# EAGLE schematic RX-Super-Regenerative-1Transistor-ElektorSeptember2007 (EAGLE 7.2.0)
Elektor FM Broadcast Super-Regenerative Receiver Burkhard Kainka's super-regenerative FM receiver from Elektor September 2007. http://www.vk2zay.net/article/195 http://siva666siva.webs.com/FM.PDF
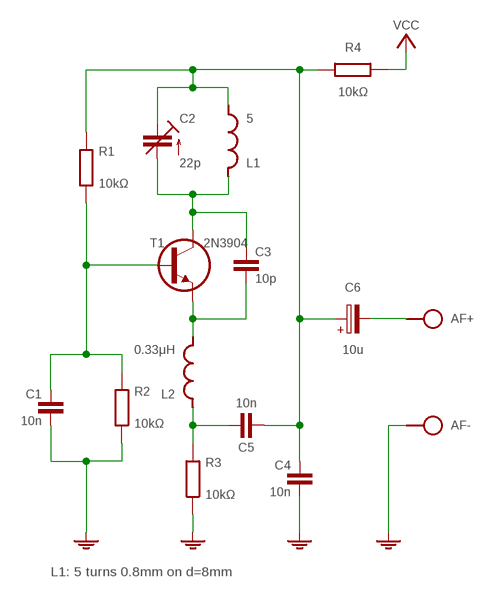
[diagram p0: schematic, sheet 1]

## Parts
AF+  SPAD  [SPAD]
AF-  SPAD  [SPAD]
C1  10n  C050-020X036/V  [C050-020X036/V]
C2  22p  C-TR-PH20127  [TRIM-2222-808]
C3  10p  C050-020X036/V  [C050-020X036/V]
C4  10n  C025-024X044  [C025-024X044]
C5  10n  C-H050-020X036  [C050-020X036]
C6  10u  CPOLE2,5-3  [E2,5-3]
L1  5  L-SHORTL-04-5/5V-X  [L-04-5/5V-X]
L2  0.33μH  L-SHORT02/7V  [L-02/7V]
R1  10kΩ  R0204/10  [0204/10]
R2  10kΩ  R0204/10  [0204/10]
R3  10kΩ  R0204/10  [0204/10]
R4  10kΩ  R0204/7  [0204/7]
S1  VCC_GNDPWR-L  [PWR-L]
T1  2N3904  [TO92]

## Nets
GND: AF-.1 C1.2 C4.2 R2.1 R3.1 S1.1
N$1: C1.1 R1.1 R2.2 T1.2(B)
N$2: AF+.1 C6.-
N$3: C5.2 L2.2 R3.2
N$4: C3.2 L2.1 T1.1(E)
N$6: C2.2(A) C3.1 L1.2 T1.3(C)
N$8: C2.1(E) C2.3(E) C4.1 C5.1 C6.+ L1.1 R1.2 R4.2
VCC: R4.1 S1.2

## Notes on the sheet
- L1: 5 turns 0.8mm on d=8mm

## Library data of the parts
AF+ AF- = pad:SPAD
C1 C3 C4 = c:C: CAPACITOR, European symbol
C2 = cap-trim:C-TR-PH20127
C5 = c:C-H
C6 = c:CPOL: POLARIZED CAPACITOR, European symbol
L1 L2 = l:L-SHORT
R1-R4 = r:R: RESISTOR, European symbol
S1 = pad:VCC_GND
T1 = t:2N3904